# Altium schematic sheet DS90UB933TRTVRQ1.SchDoc
size A3; SheetNumber: 4; SheetTotal: 6
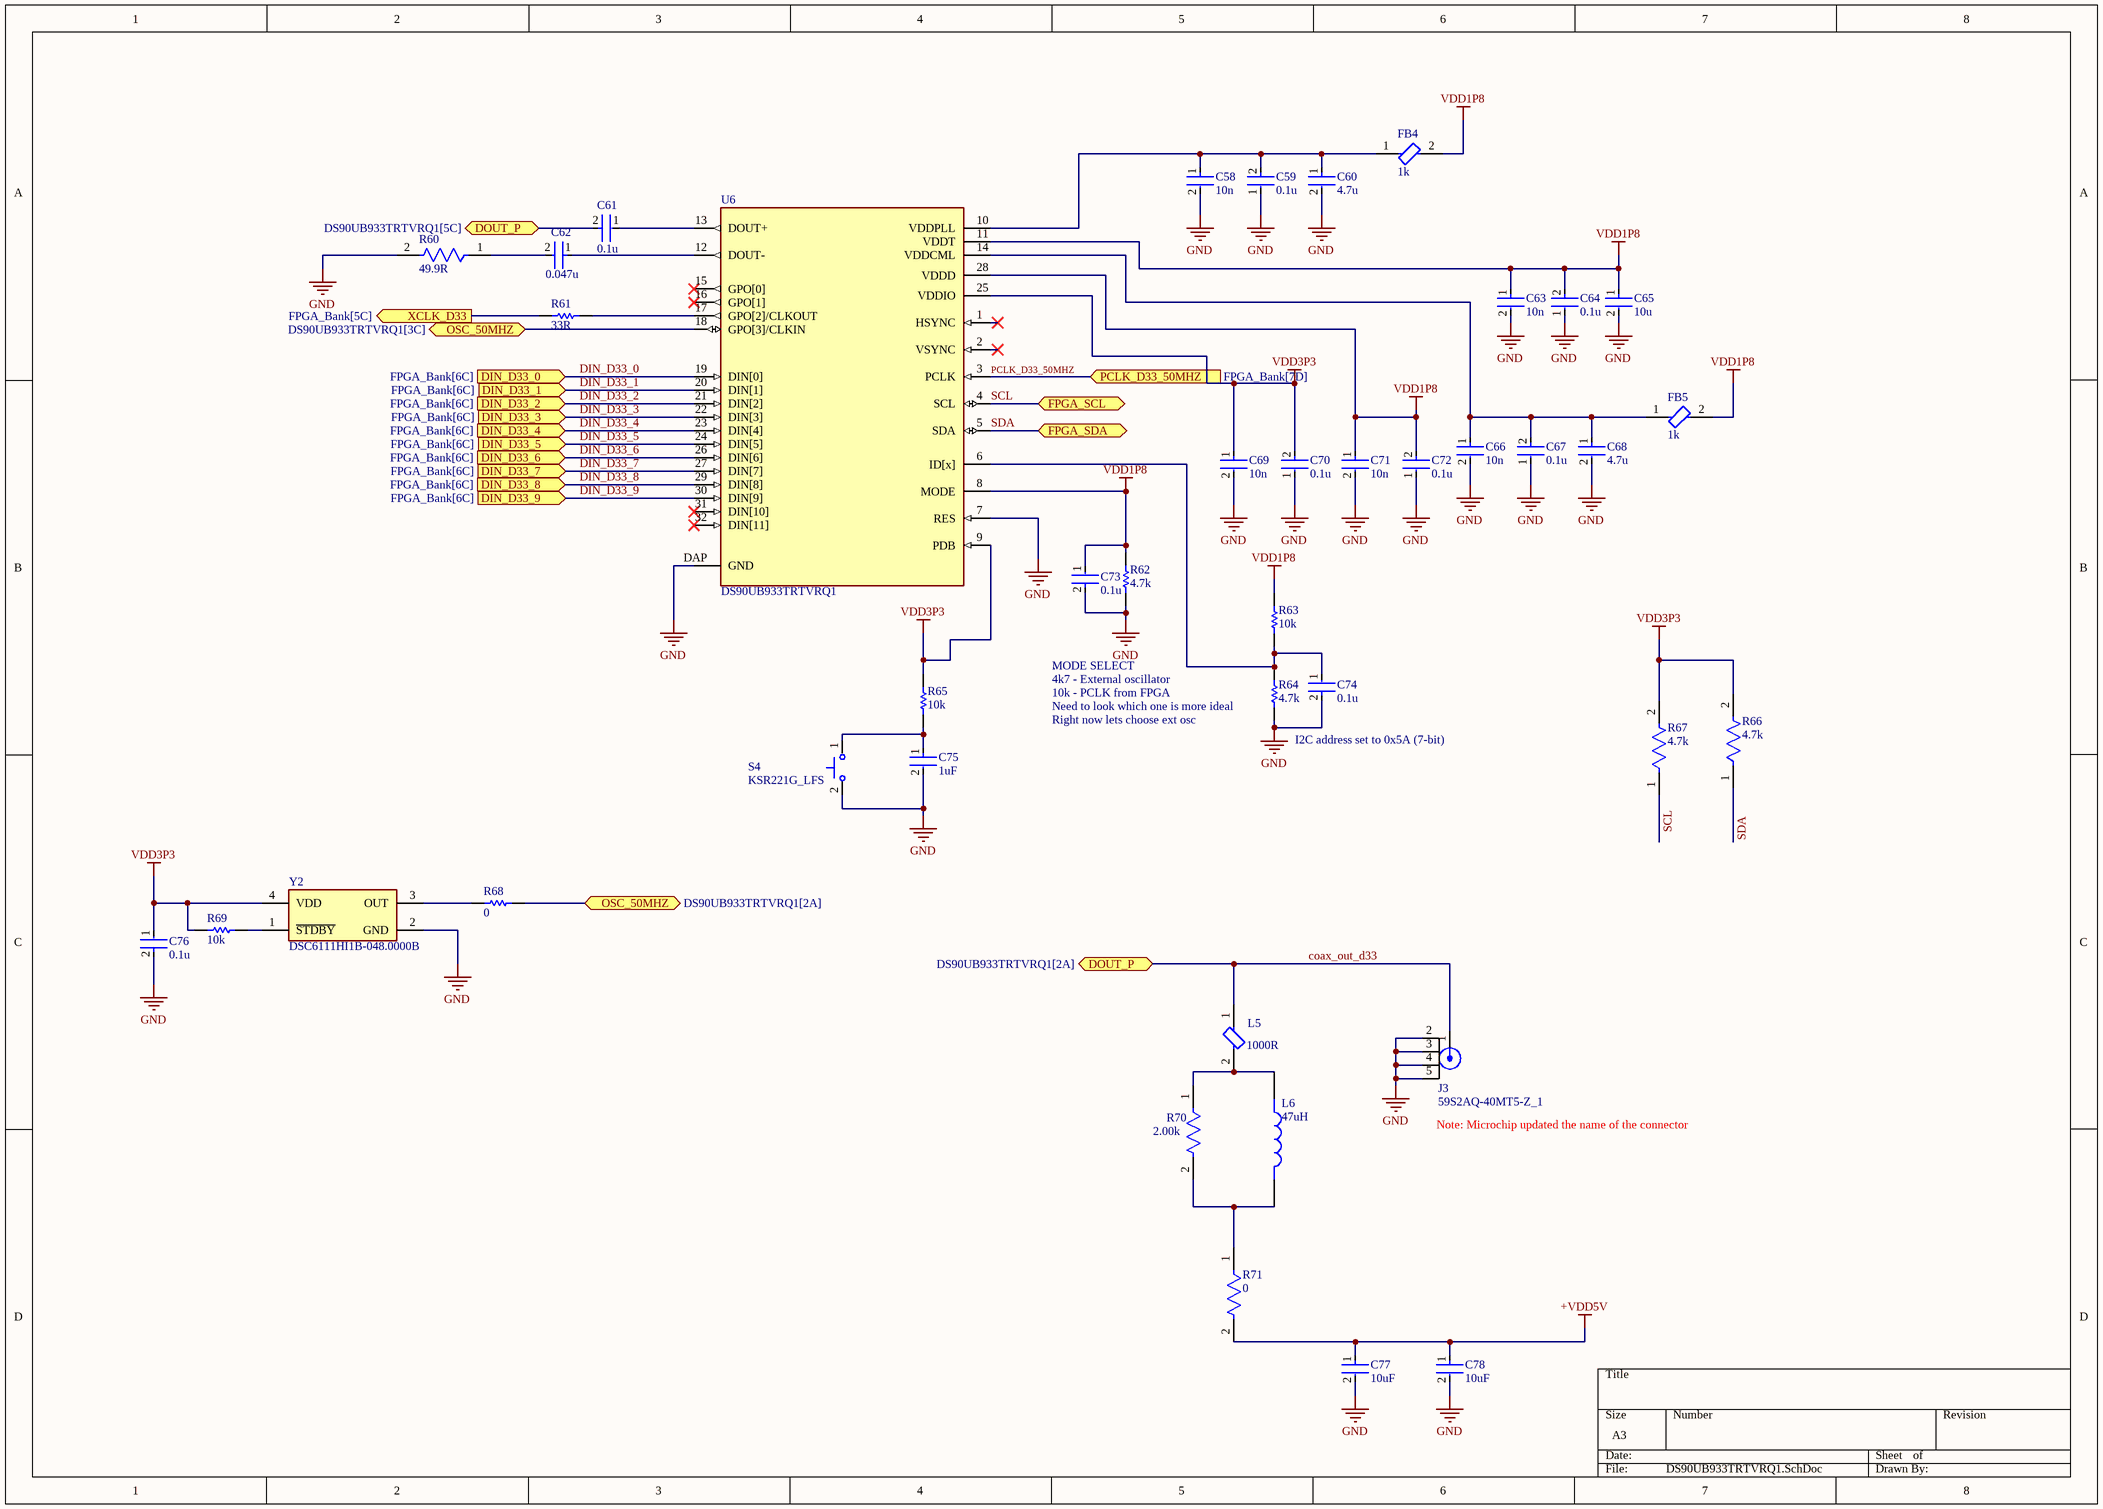
[diagram p0: DS90UB933TRTVRQ1.SchDoc]

## Parts
C58  10n  [FP-GCM155-0_05-IPC_C]
C59  0.1u  [FP-GRM15-MFG]
C60  4.7u  [FP-GRM188-0_15-IPC_C]
C61  0.1u  [FP-GRM15-MFG]
C62  0.047u  [FP-C1005-050-0_05-IPC_C]
C63  10n  [FP-GCM155-0_05-IPC_C]
C64  0.1u  [FP-GRM15-MFG]
C65  10u  [FP-GRM188-0_2-MFG]
C66  10n  [FP-GCM155-0_05-IPC_C]
C67  0.1u  [FP-GRM15-MFG]
C68  4.7u  [FP-GRM188-0_15-IPC_C]
C69  10n  [FP-GCM155-0_05-IPC_C]
C70  0.1u  [FP-GRM15-MFG]
C71  10n  [FP-GCM155-0_05-IPC_C]
C72  0.1u  [FP-GRM15-MFG]
C73  0.1u  [FP-GRM15-MFG]
C74  0.1u  [FP-GRM15-MFG]
C75  1uF  [FP-C1005-050-0_05-IPC_B]
C76  0.1u  [FP-GRM15-MFG]
C77  10uF  [FP-GRM188-0_2-MFG]
C78  10uF  [FP-GRM188-0_2-MFG]
FB4  1k  [FP-BLM15-0_05-IPC_C]
FB5  1k  [FP-BLM15-0_05-IPC_C]
J3  59S2AQ-40MT5-Z_1  [ROSENBERGER_59S2AQ-40MT5-Z_1]
L5  1000R  [FP-BLM15-0_05-IPC_C]
L6  47uH  [IND_ADL3225V-470MT-TL000]
R60  49.9R  [FP-CRCW0402-e3-MFG]
R61  33R  [RESC1005X40X25ML05T05]
R62  4.7k  [RESC1005X40X25LL05T05]
R63  10k  [RESC1005X40X25ML05T10]
R64  4.7k  [RESC1005X40X25LL05T05]
R65  10k  [RESC1005X40X25ML05T10]
R66  4.7k  [FP-CRCW0402-e3-IPC_A]
R67  4.7k  [FP-CRCW0402-e3-IPC_A]
R68  0  [RESC1005X40X25LL05T05]
R69  10k  [RESC1005X40X25ML05T10]
R70  2.00k  [FP-CRCW0402-e3-IPC_C]
R71  0  [FP-CRCW0402-e3-IPC_C]
S4  KSR221G_LFS  [KSR]
U6  DS90UB933TRTVRQ1  [FP-RTV0032A-IPC_A]
Y2  DSC6111HI1B-048.0000B  [DSC6111HI1B0480000B]

## Ports
DIN_D33_0 (in, see FPGA_Bank[6C]), DIN_D33_1 (in, see FPGA_Bank[6C]), DIN_D33_2 (in, see FPGA_Bank[6C]), DIN_D33_3 (in, see FPGA_Bank[6C]), DIN_D33_4 (in, see FPGA_Bank[6C]), DIN_D33_5 (in, see FPGA_Bank[6C]), DIN_D33_6 (in, see FPGA_Bank[6C]), DIN_D33_7 (in, see FPGA_Bank[6C]), DIN_D33_8 (in, see FPGA_Bank[6C]), DIN_D33_9 (in, see FPGA_Bank[6C]), DOUT_P (bidir, see DS90UB933TRTVRQ1[2A]), DOUT_P (bidir, see DS90UB933TRTVRQ1[5C]), FPGA_SCL (bidir, see FPGA_Bank[5A], Serializer_DS90UB913A[6D]), FPGA_SDA (bidir, see FPGA_Bank[5A], Serializer_DS90UB913A[6D]), OSC_50MHZ (bidir, see DS90UB933TRTVRQ1[2A]), OSC_50MHZ (bidir, see DS90UB933TRTVRQ1[3C]), PCLK_D33_50MHZ (in, see FPGA_Bank[7D]), XCLK_D33 (out, see FPGA_Bank[5C])

## Nets
+VDD5V: C77.1 C78.1 R71.2
GND: C58.2 C59.1 C60.2 C63.2 C64.1 C65.2 C66.2 C67.1 C68.2 C69.2 C70.1 C71.2 C72.1 C73.2 C74.2 C75.2 C76.2 C77.2 C78.2 J3.2 J3.3 J3.4 J3.5 R60.2 R62.1 R64.1 S4.2 U6.7(RES) U6.DAP(GND) Y2.2(GND)
VDD1P8: C63.1 C64.2 C65.1 C71.1 C72.2 C73.1 FB4.2 FB5.2 R62.2 R63.2 U6.8(MODE) U6.11(VDDT) U6.28(VDDD)
VDD3P3: C69.1 C70.2 C76.1 R65.2 R66.2 R67.2 R69.2 U6.9(PDB) U6.25(VDDIO) Y2.4(VDD)
coax_out_d33: C61.2 J3.1 L5.1 ; port DOUT_P
DIN_D33_0: U6.19(DIN[0]) ; port DIN_D33_0
DIN_D33_1: U6.20(DIN[1]) ; port DIN_D33_1
DIN_D33_2: U6.21(DIN[2]) ; port DIN_D33_2
DIN_D33_3: U6.22(DIN[3]) ; port DIN_D33_3
DIN_D33_4: U6.23(DIN[4]) ; port DIN_D33_4
DIN_D33_5: U6.24(DIN[5]) ; port DIN_D33_5
DIN_D33_6: U6.26(DIN[6]) ; port DIN_D33_6
DIN_D33_7: U6.27(DIN[7]) ; port DIN_D33_7
DIN_D33_8: U6.29(DIN[8]) ; port DIN_D33_8
DIN_D33_9: U6.30(DIN[9]) ; port DIN_D33_9
OSC_50MHZ: R68.2 U6.18(GPO[3]/CLKIN) ; port OSC_50MHZ
PCLK_D33_50MHZ: U6.3(PCLK) ; port PCLK_D33_50MHZ
SCL: R67.1 U6.4(SCL) ; port FPGA_SCL
SDA: R66.1 U6.5(SDA) ; port FPGA_SDA
XCLK_D33: R61.1 ; port XCLK_D33
NetC58_1: C58.1 C59.2 C60.1 FB4.1 U6.10(VDDPLL)
NetC61_1: C61.1 U6.13(DOUT+)
NetC62_1: C62.1 U6.12(DOUT-)
NetC62_2: C62.2 R60.1
NetC66_1: C66.1 C67.2 C68.1 FB5.1 U6.14(VDDCML)
NetC74_1: C74.1 R63.1 R64.2 U6.6(ID[x])
NetC75_1: C75.1 R65.1 S4.1
NetL5_2: L5.2 L6.1 R70.1
NetL6_2: L6.2 R70.2 R71.1
NetR61_2: R61.2 U6.17(GPO[2]/CLKOUT)
NetR68_1: R68.1 Y2.3(OUT)
NetR69_1: R69.1 Y2.1(~{STDBY})

Not connected (* = marked no-connect by the designer): U6 1(HSYNC)* 2(VSYNC)* 15(GPO[0])* 16(GPO[1])* 31(DIN[10])* 32(DIN[11])*

## Notes on the sheet
- MODE SELECT
- `
- 4k7 - External oscillator
- 10k - PCLK from FPGA
- (near R64) Need to look which one is more ideal
- (near R64) Right now lets choose ext osc
- I2C address set to 0x5A (7-bit)
- (near J3) Note: Microchip updated the name of the connector

## Library data of the parts
C58 C63 C66 C69 C71 = CMP-2008-03723-3: Ceramic Capacitor for Automotive 10nF ±10% 50VDC X7R 0402 Paper T/R; Voltage Rating (DC): 50V; Min Operating Temperature: -55°C; Radiation Hardening: No; Mount: Surface Mount; Thickness: 0.022inch; Package Quantity: 1; Case Code (Imperial): 0402; Lead Free: Lead Free; Case/Package: 0402; Depth: 0.5mm; Termination: SMD/SMT; Tolerance: 10%; Voltage: 50V; Packaging: Tape and Reel; Width: 0.02inch; REACH SVHC: No SVHC; Height: 0.5mm; Max Operating Temperature: 125°C; Case Code (Metric): 1005; Voltage Rating: 50V; Capacitance: 10nF; Ratings: AEC-Q200; Length: 1mm; Dielectric: X7R
C59 C61 C64 C67 C70 C72-C74 C76 = CMP-2100-03641-2: CAP CER 0.1UF 16V X7R 0402; Manufacturer Part Number: GRM155R71C104KA88D; Manufacturer: Murata; Standoff Height: 0mm; Tolerance: 10%; Voltage Rating: 16Vdc; Material: Ceramic; Capacitance: 0.10μF; Value: 0.10μF; RoHS: TRUE; Temperature Characteristic: X7R; Octopart: https://octopart.com/grm155r71c104ka88d-murata-196880; Digikey Description: CAP CER 0.1UF 16V X7R 0402; Device Class L3: Ceramic Capacitors; Height: 0.55mm; ComponentLink2Description: Datasheet; Temperature Range Low: -55°C; Ipc Land Pattern Name: CAPC10050X219; ComponentLink2URL: https://search.murata.co.jp/Ceramy/image/img/A01X/G101/ENG/GRM155R71H471KA01-01A.pdf; Device Class L1: Passive Components; Lead Free: yes; Category: Cap; Package: GRM15; Temperature: -55°C to +125°C; Device Class L2: Capacitors; Temperature Range High: +125°C; Mouser Description: 0402 0.1 uF 16V ±10 % Tolerance X7R SMT Multilayer Ceramic Capacitor
C60 C68 = CMP-2006-02523-2: Chip Multilayer Ceramic Capacitors for General Purpose, 0603, 4.7uF, X5R, 15%, 10%, 25V; Case Code (Metric): 1608; Max Operating Temperature: 85°C; REACH SVHC: No SVHC; Voltage Rating: 25V; Dielectric: X5R; Packaging: Cut Tape; Width: 0.031inch; Min Operating Temperature: -55°C; Lead Free: Lead Free; Capacitance: 4.7uF; Height: 0.8mm; Case Code (Imperial): 0603; Length: 1.6mm; Voltage Rating (DC): 25V; Case/Package: 0603; Voltage: 25V; Tolerance: 10%; Thickness: 0.031inch; Mount: Surface Mount; Material: Ceramic; Package Quantity: 4000; Depth: 0.8mm
C62 = CMP-2000-06006-2: Multilayer Ceramic Capacitors 47nF ±10% 50V X7R SMD 0402; Dissipation Factor: 5%; Weight: 2.3E-05oz; Max Operating Temperature: 125°C; Package Quantity: 1; Width: 0.02inch; Min Operating Temperature: -55°C; Length: 1mm; Dielectric: X7R; Voltage Rating: 50V; Number of Pins: 2; Lead Free: Lead Free; Voltage: 50V; Dielectric Material: Ceramic; Height: 0.5mm; Case Code (Metric): 1005; Capacitance: 47nF; Voltage Rating (DC): 50V; Construction: Flat; Termination: SMD/SMT; Case Code (Imperial): 0402; Depth: 0.5mm; Packaging: Tape and Reel; Mount: Surface Mount; Series: C; RoHS Compliant: Yes; Tolerance: 10%; Case/Package: 0402; Thickness: 0.022inch; Radiation Hardening: No; Resistor Type: Ceramic; REACH SVHC: No SVHC
C65 C77 C78 = CMP-2006-02520-2: Chip Multilayer Ceramic Capacitors for General Purpose, 0603, 10uF, X5R, 15%, 20%, 25V; Tolerance: 20%; Resistor Type: Ceramic; Voltage: 25V; Max Operating Temperature: 85°C; Min Operating Temperature: -55°C; Capacitance: 10uF; Dielectric: X5R; Lead Free: Lead Free; REACH SVHC: No SVHC; Case/Package: 0603; Mount: Surface Mount; Voltage Rating (DC): 25V; Height: 0.8mm; Length: 1.6mm; Thickness: 0.031inch; Width: 0.031inch; Termination: SMD/SMT; Case Code (Imperial): 0603; Case Code (Metric): 1608; Package Quantity: 1; Packaging: Tape and Reel; Depth: 0.8mm; Voltage Rating: 25V; Weight: 0.000222oz; Number of Pins: 2
C75 = CMP-2000-06001-2: Multilayer Ceramic Capacitors 1μF ±10% 25V X5R SMD 0402; Package Quantity: 1; Radiation Hardening: No; Dielectric: X5R; REACH SVHC: No SVHC; RoHS Compliant: Yes; Case Code (Imperial): 0402; Voltage Rating: 25V; Termination: SMD/SMT; Max Operating Temperature: 85°C; Capacitance: 1uF; Series: C; Packaging: Tape and Reel; Tolerance: 10%; Voltage Rating (DC): 25V; Weight: 2.3E-05oz; Height: 0.5mm; Resistor Type: Ceramic; Thickness: 0.022inch; Min Operating Temperature: -55°C; Length: 1mm; Lead Free: Lead Free; Depth: 0.5mm; Dielectric Material: Ceramic; Width: 0.02inch; Case/Package: 0402; Case Code (Metric): 1005; Mount: Surface Mount
FB4 FB5 L5 = CMP-0686-00279-4: Chip Ferrite Bead, 0402, 1000Ω @ 100MHz, 1.25Ω, 25%, 250mA; Manufacturer Series: BLM15H; Number of Functions: 1; DC Resistance-Max: 1.25R; Impedance: 1kR; Shielding: Unshielded; Material: Steel; Series: BLM15H; Case Code (Metric): 1005; Contact Plating: Tin; Width: 0.5mm; Current Rating: 250mA; Number of Circuits: 1; Min Operating Temperature: -55°C; Number of Pins: 2; Core Material: Ferrite; Packaging: Tape and Reel; DC Resistance (DCR): 1.25R; Height: 0.5mm; REACH SVHC: No SVHC; Max Current Rating: 250mA; Depth: 0.5mm; Tolerance: 25%; Termination: SMD/SMT; RoHS Compliant: Yes; Package Quantity: 1; Number of Lines: 1; Max DC Current: 250mA; Radiation Hardening: No; Resistance: 1.25R; Lead Free: Lead Free; DC Current: 250mA; Length: 1mm; Test Frequency: 100MHz; Frequency: 100MHz; Case Code (Imperial): 0402; Max Operating Temperature: 125°C; Case/Package: 0402; Military Standard: Not
J3 = 59S2AQ-40MT5-Z_1: RF Connectors / Coaxial Connectors Plug PC-Board SMD Right AngleZWatrBlue; Package: None; Price: None; Value: *; MP: 59S2AQ-40MT5-Z_1; Availability: Unavailable
L6 = ADL3225V-470MT-TL000: MF: {'manufacturer': u'TDK'}; Value: *; Availability: Unavailable; MP: ADL3225V-470MT-TL000; Price: None; Package: None
R60 = CMP-1011-00363-3: RES Thick Film, 49.9Ω, 1%, 0.063W, 100ppm/°C, 0402; Voltage Rating: 50V; Power Rating: 63mW; Temperature Coefficient: 100ppm/°C; Resistance: 49.9R; Packaging: Tape and Reel; Height: 0.35mm; Length: 1mm; Case Code (Metric): 1005; Weight: 2.3E-05oz; Case Code (Imperial): 0402; Voltage Rating (DC): 50V; Composition: Thick Film; Lead Free: Lead Free; Package Quantity: 10; Number of Terminations: 2; Width: 0.5mm; Max Operating Temperature: 155°C; Depth: 0.5mm; Max Power Dissipation: 63mW; Tolerance: 1%; Radiation Hardening: No; Features: Automotive AEC-Q200; Min Operating Temperature: -55°C; Contact Plating: Tin; Mount: Surface Mount; Military Standard: Not; Termination: SMD/SMT; Case/Package: 0402
R61 = CMP-2002-08531-1: Manufacturer: Vishay Dale; Part Number: CRCW040233R0JNED
R62 R64 = CMP-2002-01154-4: Chip Resistor, 4.7 KOhm, +/- 1%, 0.1 W, -55 to 155 degC, 0402 (1005 Metric), RoHS, Tape and Reel; PartNumber: ERJ-2RKF4701X; Voltage Rating: 50 V; Case\/Package: 0402; Power Rating: 100 mW; Height: 0.35 mm; Mounting Technology: Surface Mount; REACH SVHC: Yes; Resistance: 4.7 KOhm; Max Operating Temperature: 155 degC; ComponentLink1Description: Manufacturer URL; ComponentLink2Description: Datasheet; Pins: 2; PackageReference: 0402; Tolerance: 1%; Case Code (Imperial): 0402; Length: 1 mm; PackageDescription: 2-Pin Surface Mount Device, Body 1 x 0.5 mm; RoHSCompliant: true; Package Quantity: 1; Radiation Hardening: No; DatasheetVersion: 04/2015; Width: 0.5 mm; Case Code (Metric): 1005; Mount: Surface Mount; ComponentLink1URL: http://www.panasonic.com/; Min Operating Temperature: -55 degC; Packaging: Cut Tape; ComponentLink2URL: http://industrial.panasonic.com/cdbs/www-data/pdf/RDA0000/AOA0000C86.pdf
R63 R65 R69 = CMP-2002-03043-1: Part Number: CRCW040210K0FKEDHP; Manufacturer: Vishay Dale
R66 R67 = CMP-2002-00052-3: RES Thick Film, 4.7kΩ, 5%, 0.063W, 200ppm/°C, 0402; Power Rating: 63mW; Resistance: 4.7kR; Voltage Rating: 50V; Case Code (Metric): 1005; Case/Package: 0402; Composition: Thick Film; Depth: 0.5mm; Min Operating Temperature: -55°C; Temperature Coefficient: 200ppm/°C; Max Power Dissipation: 63mW; Packaging: Tape and Reel; Max Operating Temperature: 155°C; Number of Terminations: 2; Width: 0.5mm; Height: 0.35mm; Contact Plating: Tin; Package Quantity: 1; Length: 1mm; Termination: SMD/SMT; Radiation Hardening: No; Weight: 2.3E-05oz; Military Standard: Not; Case Code (Imperial): 0402; Features: Automotive AEC-Q200; Tolerance: 5%
R68 = CMP-2000-07451-1: Chip Resistor, 0 Ohm, 0.1 W, -55 to 155 degC, 0402 (1005 Metric), RoHS, Tape and Reel; Manufacturer: Panasonic; Voltage Rating (DC): 50V; Temperature Coefficient: 600ppm/��C; Max Power Dissipation: 100mW; Resistance: 0mOhm; Tolerance: 5%; Number of Terminations: 2; Mount: SurfaceMount; Height: 0.35mm; Packaging: TapeandReel; Contact Plating: Tin; Manufacturer URL: http://www.panasonic.com/; Composition: ThickFilm; Max Operating Temperature: 155degC; REACH SVHC: NoSVHC; Case/Package: 0402; Package Reference: 402; Depth: 0.5mm; Package Description: 2-Pin Surface Mount Device, Body 1 x 0.5 mm; Datasheet URL: https://industrial.panasonic.com/cdbs/www-data/pdf/RDA0000/AOA0000C301.pdf; RoHSCompliant: True; Case Code (Imperial): 0402; Military Standard: Not; Min Operating Temperature: -55degC; Power Rating: 100mW; Datasheet Version: 03/2015; Length: 1mm; Case Code (Metric): 1005; Termination: SMD/SMT; Mounting Technology: SurfaceMount; Voltage Rating: 50V; Width: 0.02inch; Package Quantity: 1; Lead Free: LeadFree; Radiation Hardening: No
R70 R71 = CMP-2002-08122-2: RES Thick Film, 0Ω, 0.063W, 0402; Tolerance: 5%; Max Power Dissipation: 63mW; Voltage Rating: 50V; Temperature Coefficient: 100ppm/°C; Resistance: 0mR; Contact Plating: Tin; Height: 0.35mm; Radiation Hardening: No; Features: Automotive AEC-Q200; Composition: Thick Film; Width: 0.5mm; Weight: 2.3E-05oz; Termination: SMD/SMT; Packaging: Tape and Reel; Mount: Surface Mount; Case Code (Metric): 1005; Military Standard: Not; Min Operating Temperature: -55°C; Number of Terminations: 2; Package Quantity: 1; Case Code (Imperial): 0402; Depth: 0.5mm; Max Operating Temperature: 155°C; Case/Package: 0402; Power Rating: 63mW; Lead Free: Lead Free; Voltage Rating (DC): 50V; Length: 1mm
S4 = KSR221G_LFS: Switch; Manufacturer_Name: C & K COMPONENTS; Manufacturer_Part_Number: KSR221G LFS; Datasheet Link: http://www.ckswitches.com/media/1466/ksr.pdf; Mouser Part Number: 611-KSR221G-LFS; Mouser Price/Stock: https://www.mouser.co.uk/ProductDetail/CK/KSR221G-LFS?qs=nrpkpS80q8EnsbmSijdd7Q%3D%3D; Arrow Part Number: KSR221G LFS; Arrow Price/Stock: https://www.arrow.com/en/products/ksr221glfs/ck?utm_currency=USD&region=europe
U6 = CMP-04882-000010-1: IC SERIALIZER FPD-LINK 32WQFN; Number of Inputs: 12; Number of Outputs: 2; RoHS Compliant: Yes; Min Operating Temperature: -40°C; Mount: Surface Mount; Packaging: Tape and Reel; Max Operating Temperature: 105°C
Y2 = DSC6111HI1B-048.0000B: Crystal or Oscillator; Manufacturer_Name: Microchip; Datasheet Link: https://ww1.microchip.com/downloads/aemDocuments/documents/TCG/ProductDocuments/DataSheets/DSC61xxB-Ultra-Small-Ultra-Low-Power-MEMS-Oscillator-DS20006155.pdf; Height: 0.89mm; Manufacturer_Part_Number: DSC6111HI1B-048.0000B